# EAGLE schematic c64switchless_555 (EAGLE 6.0)
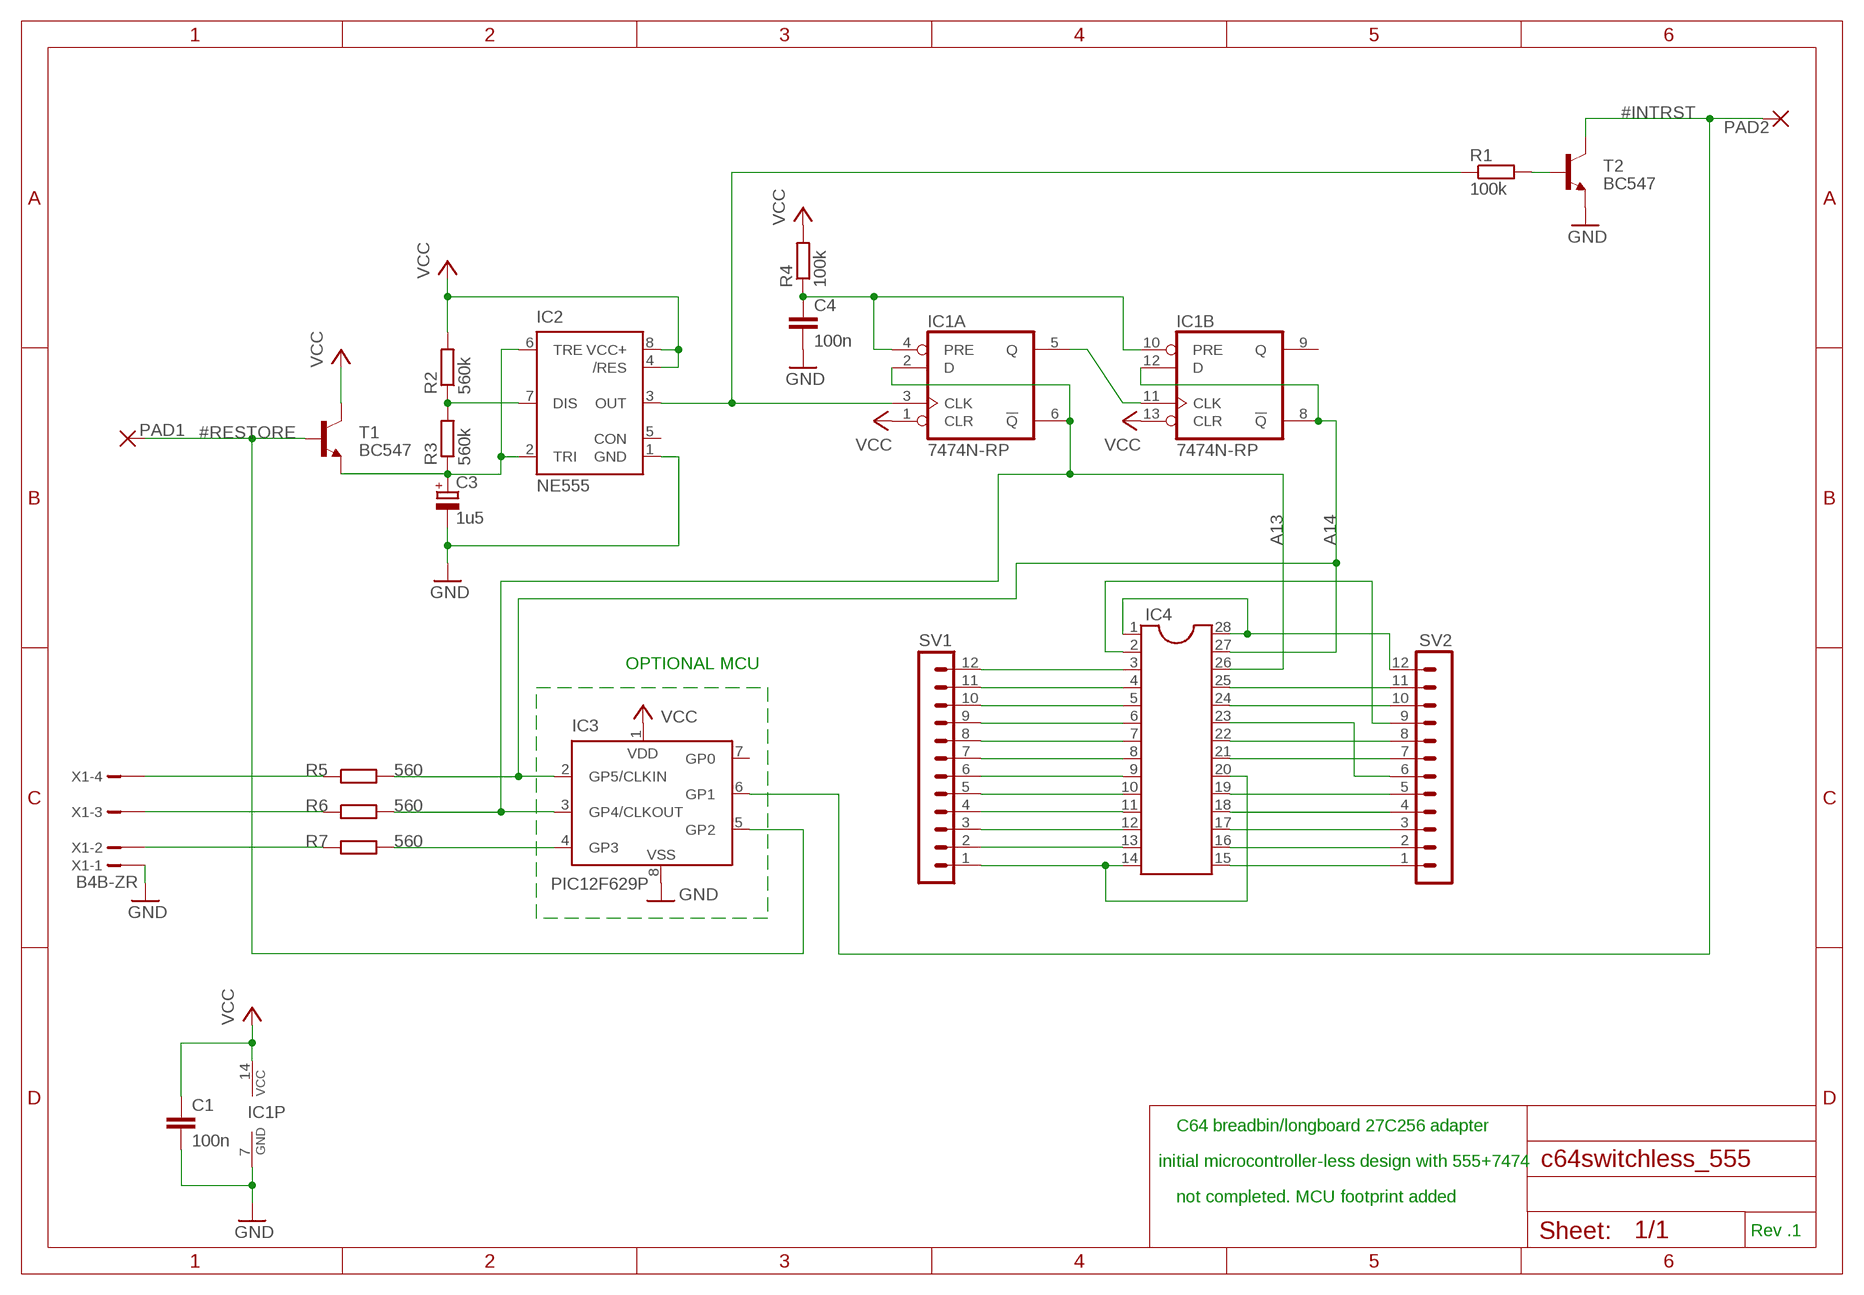
[diagram p0: schematic, sheet 1]

## Parts
C1  100n  C-EU050-030X075  [C050-030X075]
C3  1u5  CPOL-EUE2.5-6  [E2,5-6]
C4  100n  C-EU050-030X075  [C050-030X075]
IC1  7474N-RP  [DIL14-ROUNDPADS]
IC2  NE555  [DIL-08]
IC3  PIC12F629P  [DIL8]
IC4  DIL28ROUND  [DIL28SPECIAL]
PAD1  WIREPAD2,54/1,0  [2,54/1,0]
PAD2  WIREPAD2,54/1,0  [2,54/1,0]
R1  100k  R-EU_0204/7  [0204/7]
R2  560k  R-EU_0204/7  [0204/7]
R3  560k  R-EU_0204/7  [0204/7]
R4  100k  R-EU_0204/7  [0204/7]
R5  560  R-EU_0204/7  [0204/7]
R6  560  R-EU_0204/7  [0204/7]
R7  560  R-EU_0204/7  [0204/7]
SV1  MA12-1ROUND  [MA12-1ROUND]
SV2  MA12-1ROUND  [MA12-1ROUND]
T1  BC547  [TO92]
T2  BC547  [TO92]
X1  B4B-ZR  [B4B-ZR]

## Nets
#INTRST: IC3.6(GP1) PAD2.1(P) T2.3(C)
#RESTORE: IC3.5(GP2) PAD1.1(P) T1.2(B)
A13: IC1.2(A:D) IC1.6(A:!Q) IC3.3(GP4/CLKOUT) IC4.26 R6.2
A14: IC1.8(B:!Q) IC1.12(B:D) IC3.2(GP5/CLKIN) IC4.27 R5.2
GND: C1.2 C3.- C4.2 IC1.7(P:GND) IC2.1(GND) IC3.8(VSS) T2.1(E) X1.1
N$1: IC4.14 IC4.20 SV1.1
N$2: IC4.13 SV1.2
N$3: IC4.12 SV1.3
N$4: IC4.11 SV1.4
N$5: IC4.10 SV1.5
N$6: IC4.9 SV1.6
N$7: IC4.8 SV1.7
N$8: IC4.7 SV1.8
N$9: IC4.6 SV1.9
N$10: IC4.5 SV1.10
N$11: IC4.4 SV1.11
N$12: IC4.3 SV1.12
N$13: IC4.15 SV2.1
N$14: IC4.16 SV2.2
N$15: IC4.17 SV2.3
N$16: IC4.18 SV2.4
N$17: IC4.19 SV2.5
N$18: IC4.21 SV2.7
N$19: IC4.22 SV2.8
N$20: IC4.24 SV2.10
N$21: IC4.25 SV2.11
N$22: IC4.1 IC4.28 SV2.12
N$23: IC4.23 SV2.6
N$24: IC4.2 SV2.9
N$25: R1.2 T2.2(B)
N$26: C3.+ IC2.2(TRI) IC2.6(TRE) R3.1 T1.1(E)
N$27: IC2.7(DIS) R2.1 R3.2
N$28: IC3.4(GP3) R7.2
N$29: IC1.5(A:Q) IC1.11(B:CLK)
N$31: C4.1 IC1.4(A:PRE) IC1.10(B:PRE) R4.1
N$32: R5.1 X1.4
N$33: R6.1 X1.3
N$34: R7.1 X1.2
N$35: IC1.3(A:CLK) IC2.3(OUT) R1.1
VCC: C1.1 IC1.1(A:CLR) IC1.13(B:CLR) IC1.14(P:VCC) IC2.4(/RES) IC2.8(VCC+) IC3.1(VDD) R2.2 R4.2 T1.3(C)
Unconnected: IC1.9(B:Q) IC2.5(CON) IC3.7(GP0)

## Notes on the sheet
- OPTIONAL MCU
- C64 breadbin/longboard 27C256 adapter
- initial microcontroller-less design with 555+7474
- not completed. MCU footprint added
- Rev .1

## Library data of the parts
C1 C4 = rcl:C-EU: CAPACITOR, European symbol
C3 = rcl:CPOL-EU: POLARIZED CAPACITOR, European symbol
IC1 = 74xx-eu:74*74: Dual D type positive edge triggered FLIP FLOP, preset and clear
IC2 = st-microelectronics:NE555: General purpose bipolar Timer; MF: Arrow Electronics; MPN: NE555N; OC_FARNELL: 1467742; OC_NEWARK: 89K1486
IC3 = microchip:PIC12F6*: Data Sheet 8-Pin FLASH-Based 8-Bit CMOS Microcontrollers Source: http://www.microchip.com .. 41190c.pdf; MF: MICROCHIP; MPN: PIC12F629-I/P; OC_FARNELL: 1292253; OC_NEWARK: 67K0822
IC4 = ic-package_edit:DIL28: Dual In Line
PAD1 PAD2 = wirepad:WIREPAD: Wire PAD connect wire on PCB
R1-R7 = rcl:R-EU_: RESISTOR, European symbol
SV1 SV2 = con-lstb:MA12-1: PIN HEADER
T1 T2 = transistor:BC547: NPN TRANSISTOR
X1 = con-jst:?4B-ZR: ZH CONNECTOR 1.5 mm, 4 pin 1 row Source: http://www.jst.com .. eZH.pdf; MF: FARNELL; MPN: B4B-ZR(LF)(SN); OC_FARNELL: 1830916; OC_NEWARK: 37K9960